# EasyEDA schematic Nakuja.json
TITLE: NAKUJA_IMPROVED_N1; REV: 1.0; Date: 2021-06-08; Sheet: 1/1; Company: NAKUJA PROJECT
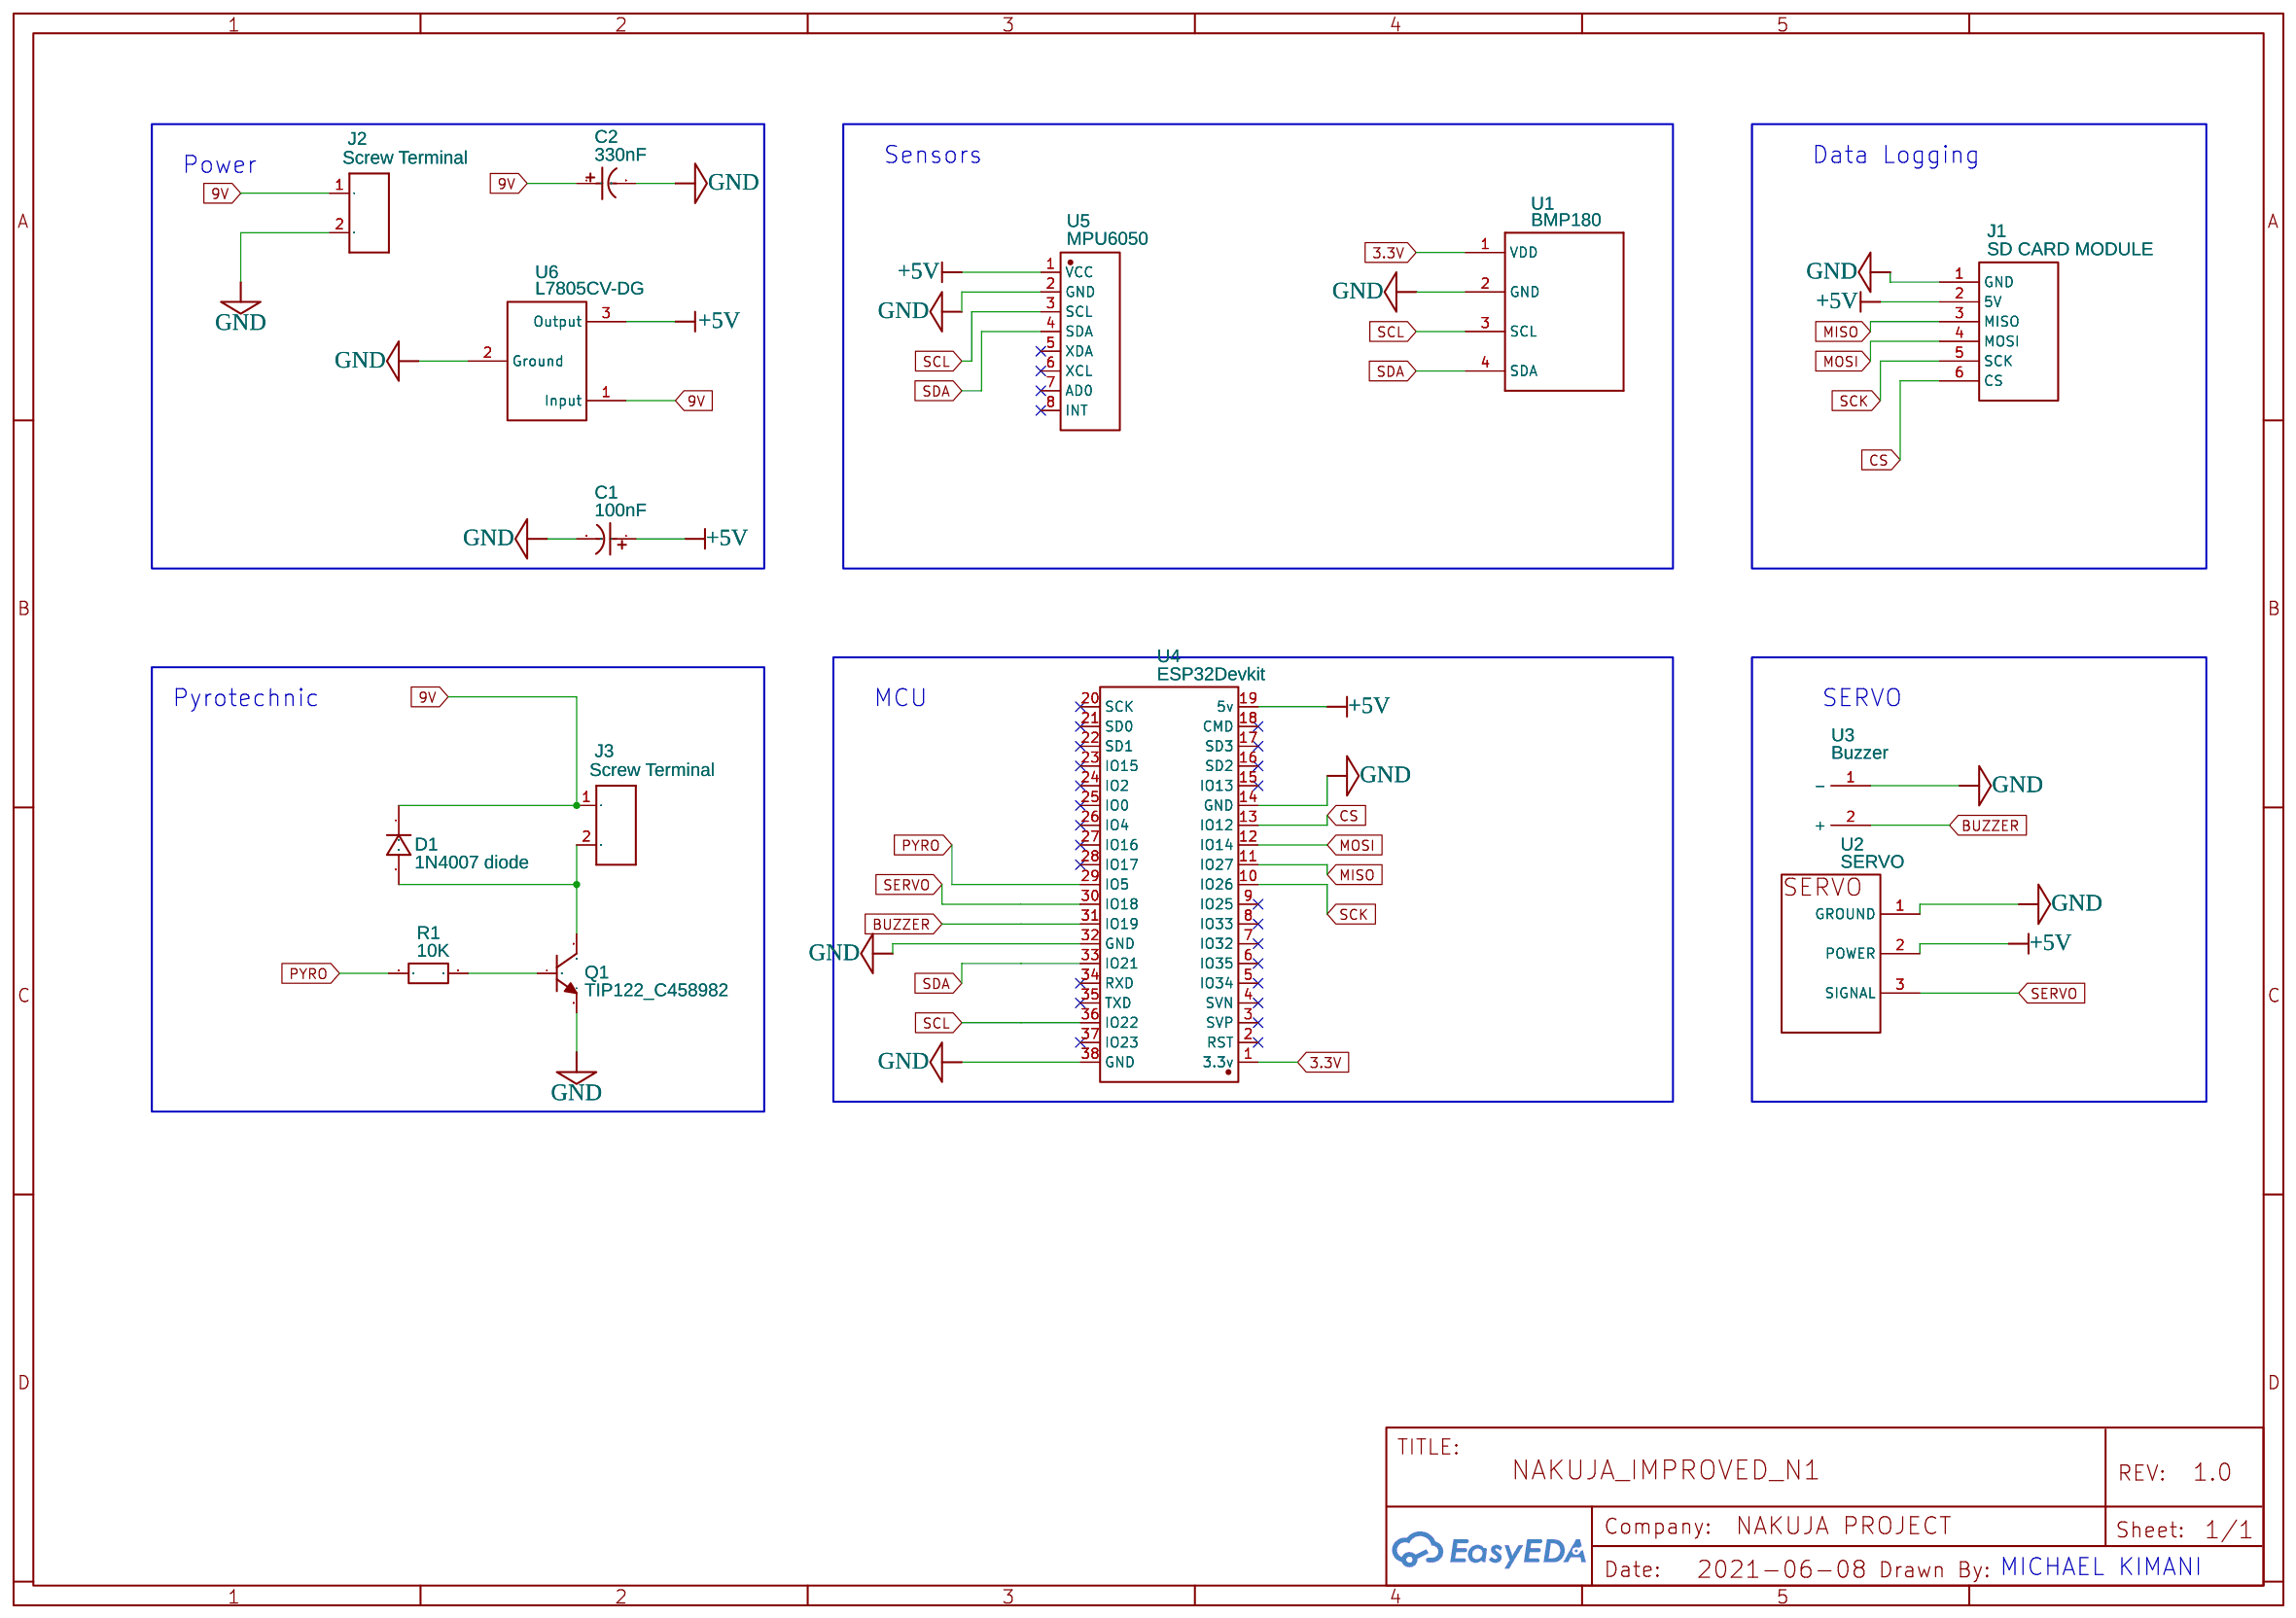
[diagram p0: schematic sheet]

## Parts
C1  100nF  [CAP-TH_BD5.0-P2.00-D0.8-FD]
C2  330nF  [CAP-TH_BD5.0-P2.00-D0.8-FD]
D1  1N4007 diode  [DIODE 1N40001]
J1  SD CARD MODULE  [SD CARD MODULE]
J2  Screw Terminal  [H2-3.5-7.0X7.0MM]
J3  Screw Terminal  [H2-3.5-7.0X7.0MM]
Q1  TIP122_C458982  [TO-220-3_L10.0-W4.5-P2.54-L]
R1  10K  [RES-TH_BD1.7-L3.5-P7.50-D0.5]
U1  BMP180  [PIN_STRIP_4]
U2  SERVO  [SERVO 3PIN]
U3  Buzzer  [BUZZER]
U4  ESP32Devkit  [ESP32-DEVKITC2]
U5  MPU6050  [HDR-F-2.54_1X8]
U6  L7805CV-DG  [TO-220-3_L10.0-W4.5-P2.54-L]

## Library data of the parts
C1 = 0.1UF 50V: Supplier: LCSC; Manufacturer: ValuePro; Supplier Part: C28061; JLCPCB Part Class: Extended Part
C2 = 0.33uF 50V 5*11: Supplier: LCSC; Manufacturer: ValuePro; Supplier Part: C45097; JLCPCB Part Class: Extended Part
D1 = 1N4007 diode: Supplier: elnino; Supplier Part: C331633; Manufacturer: GW; Manufacturer Part: 1N4007; Contributor: elnino
J1 = SD CARD MODULE: Manufacturer Part: GREATZT 1pcs Micro SD card mini TF card reader module; Supplier: Aliexpress; Contributor: Nicolas VUAGNAT
J2 J3 = Screw Terminal: Manufacturer Part: ?
Q1 = TIP122_C458982: Supplier: LCSC; Supplier Part: C458982; Manufacturer: Slkor(SLKORMICRO Elec.); Manufacturer Part: TIP122; Contributor: LCSC; JLCPCB Part Class: Extended Part
R1 = RN 1/8W 10K F T/B A1: Supplier: LCSC; Supplier Part: C433502; Manufacturer: TyoHM; Contributor: LCSC; JLCPCB Part Class: Extended Part
U1 = BMP180: Contributor: SparkFun
U2 = SERVO: Contributor: eyuen1
U3 = Buzzer: Contributor: lensingmj
U4 = ESP32Devkit: Contributor: yudhabhakti95; subpart_no: 1
U5 = MPU6050: Contributor: TRobi
U6 = L7805CV-DG: Supplier: LCSC; Manufacturer: STMicroelectronics; Supplier Part: C3795; JLCPCB Part Class: Extended Part

## Nets
3.3V: U1.1(VDD) U4.1(3.3v)
9V: C2.1 D1.1 J2.1 J3.1 U6.1(Input)
+5V: C1.1 J1.2(5V) U2.2(POWER) U4.19(5v) U5.1(VCC) U6.3(Output)
GND: C1.2 C2.2 J1.1(GND) J2.2 Q1.3(E) U1.2(GND) U2.1(GROUND) U3.1(-) U4.14(GND) U4.32(GND) U4.38(GND) U5.2(GND) U6.2(Ground)
BUZZER: U3.2(+) U4.31(IO19)
CS: J1.6(CS) U4.13(IO12)
MISO: J1.3(MISO) U4.11(IO27)
MOSI: J1.4(MOSI) U4.12(IO14)
PYRO: R1.2 U4.29(IO5)
SCK: J1.5(SCK) U4.10(IO26)
SCL: U1.3(SCL) U4.36(IO22) U5.3(SCL)
SDA: U1.4(SDA) U4.33(IO21) U5.4(SDA)
SERVO: U2.3(SIGNAL) U4.30(IO18)
Net-(D1-2): D1.2 J3.2 Q1.2(C)
Net-(Q1-1): Q1.1(B) R1.1

Not connected (* = marked no-connect by the designer): U4 2(RST)* 3(SVP)* 4(SVN)* 5(IO34)* 6(IO35)* 7(IO32)* 8(IO33)* 9(IO25)* 15(IO13)* 16(SD2)* 17(SD3)* 18(CMD)* 20(SCK)* 21(SD0)* 22(SD1)* 23(IO15)* 24(IO2)* 25(IO0)* 26(IO4)* 27(IO16)* 28(IO17)* 34(RXD)* 35(TXD)* 37(IO23)*; U5 5(XDA)* 6(XCL)* 7(AD0)* 8(INT)*

## Notes on the sheet
- Power
- Sensors
- Data Logging
- Pyrotechnic
- MCU
- SERVO
- MICHAEL KIMANI
